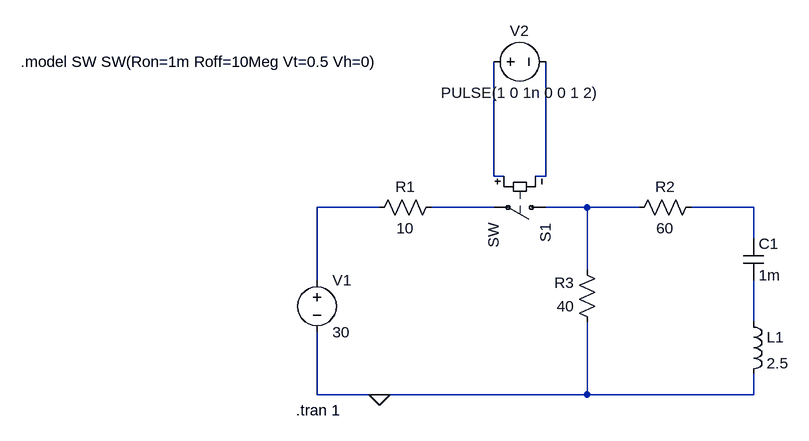
[diagram p0: schematic Q8_16.asc]
Q8_16.asc, the LTspice schematic file:
Version 4
SHEET 1 880 680
WIRE 272 -32 272 -208
WIRE 288 -32 272 -32
WIRE 352 -32 352 -208
WIRE 352 -32 336 -32
WIRE 96 16 0 16
WIRE 272 16 176 16
WIRE 416 16 352 16
WIRE 496 16 416 16
WIRE 672 16 576 16
WIRE 672 64 672 16
WIRE 416 112 416 16
WIRE 0 128 0 16
WIRE 672 192 672 128
WIRE 0 304 0 208
WIRE 96 304 0 304
WIRE 416 304 416 192
WIRE 416 304 96 304
WIRE 672 304 672 272
WIRE 672 304 416 304
FLAG 96 304 0
SYMBOL voltage 0 112 R0
WINDOW 123 0 0 Left 0
WINDOW 39 0 0 Left 0
SYMATTR InstName V1
SYMATTR Value 30
SYMBOL res 192 0 R90
WINDOW 0 0 56 VBottom 2
WINDOW 3 32 56 VTop 2
SYMATTR InstName R1
SYMATTR Value 10
SYMBOL res 592 0 R90
WINDOW 0 0 56 VBottom 2
WINDOW 3 32 56 VTop 2
SYMATTR InstName R2
SYMATTR Value 60
SYMBOL res 432 208 R180
WINDOW 0 36 76 Left 2
WINDOW 3 36 40 Left 2
SYMATTR InstName R3
SYMATTR Value 40
SYMBOL ind 656 176 R0
SYMATTR InstName L1
SYMATTR Value 2.5
SYMBOL cap 656 64 R0
SYMATTR InstName C1
SYMATTR Value 1m
SYMBOL sw 368 16 R90
SYMATTR InstName S1
SYMBOL voltage 256 -208 R270
WINDOW 0 32 56 VTop 2
WINDOW 3 -32 56 VBottom 2
WINDOW 123 0 0 Left 0
WINDOW 39 0 0 Left 0
SYMATTR InstName V2
SYMATTR Value PULSE(1 0 1n 0 0 1 2)
TEXT -32 328 Left 2 !.tran 1
TEXT -456 -208 Left 2 !.model SW SW(Ron=1m Roff=10Meg Vt=0.5 Vh=0)

The netlist it stands for:
* Q8_16.asc
V1 N003 0 30
R1 N004 N003 10
R2 N006 N005 60
R3 0 N005 40
L1 N007 0 2.5
C1 N006 N007 1m
S1 N005 N004 N001 N002 SW
V2 N001 N002 PULSE(1 0 1n 0 0 1 2)
.tran 1
.model SW SW(Ron=1m Roff=10Meg Vt=0.5 Vh=0)
.backanno
.end